# EAGLE design infant (EAGLE 6.4)
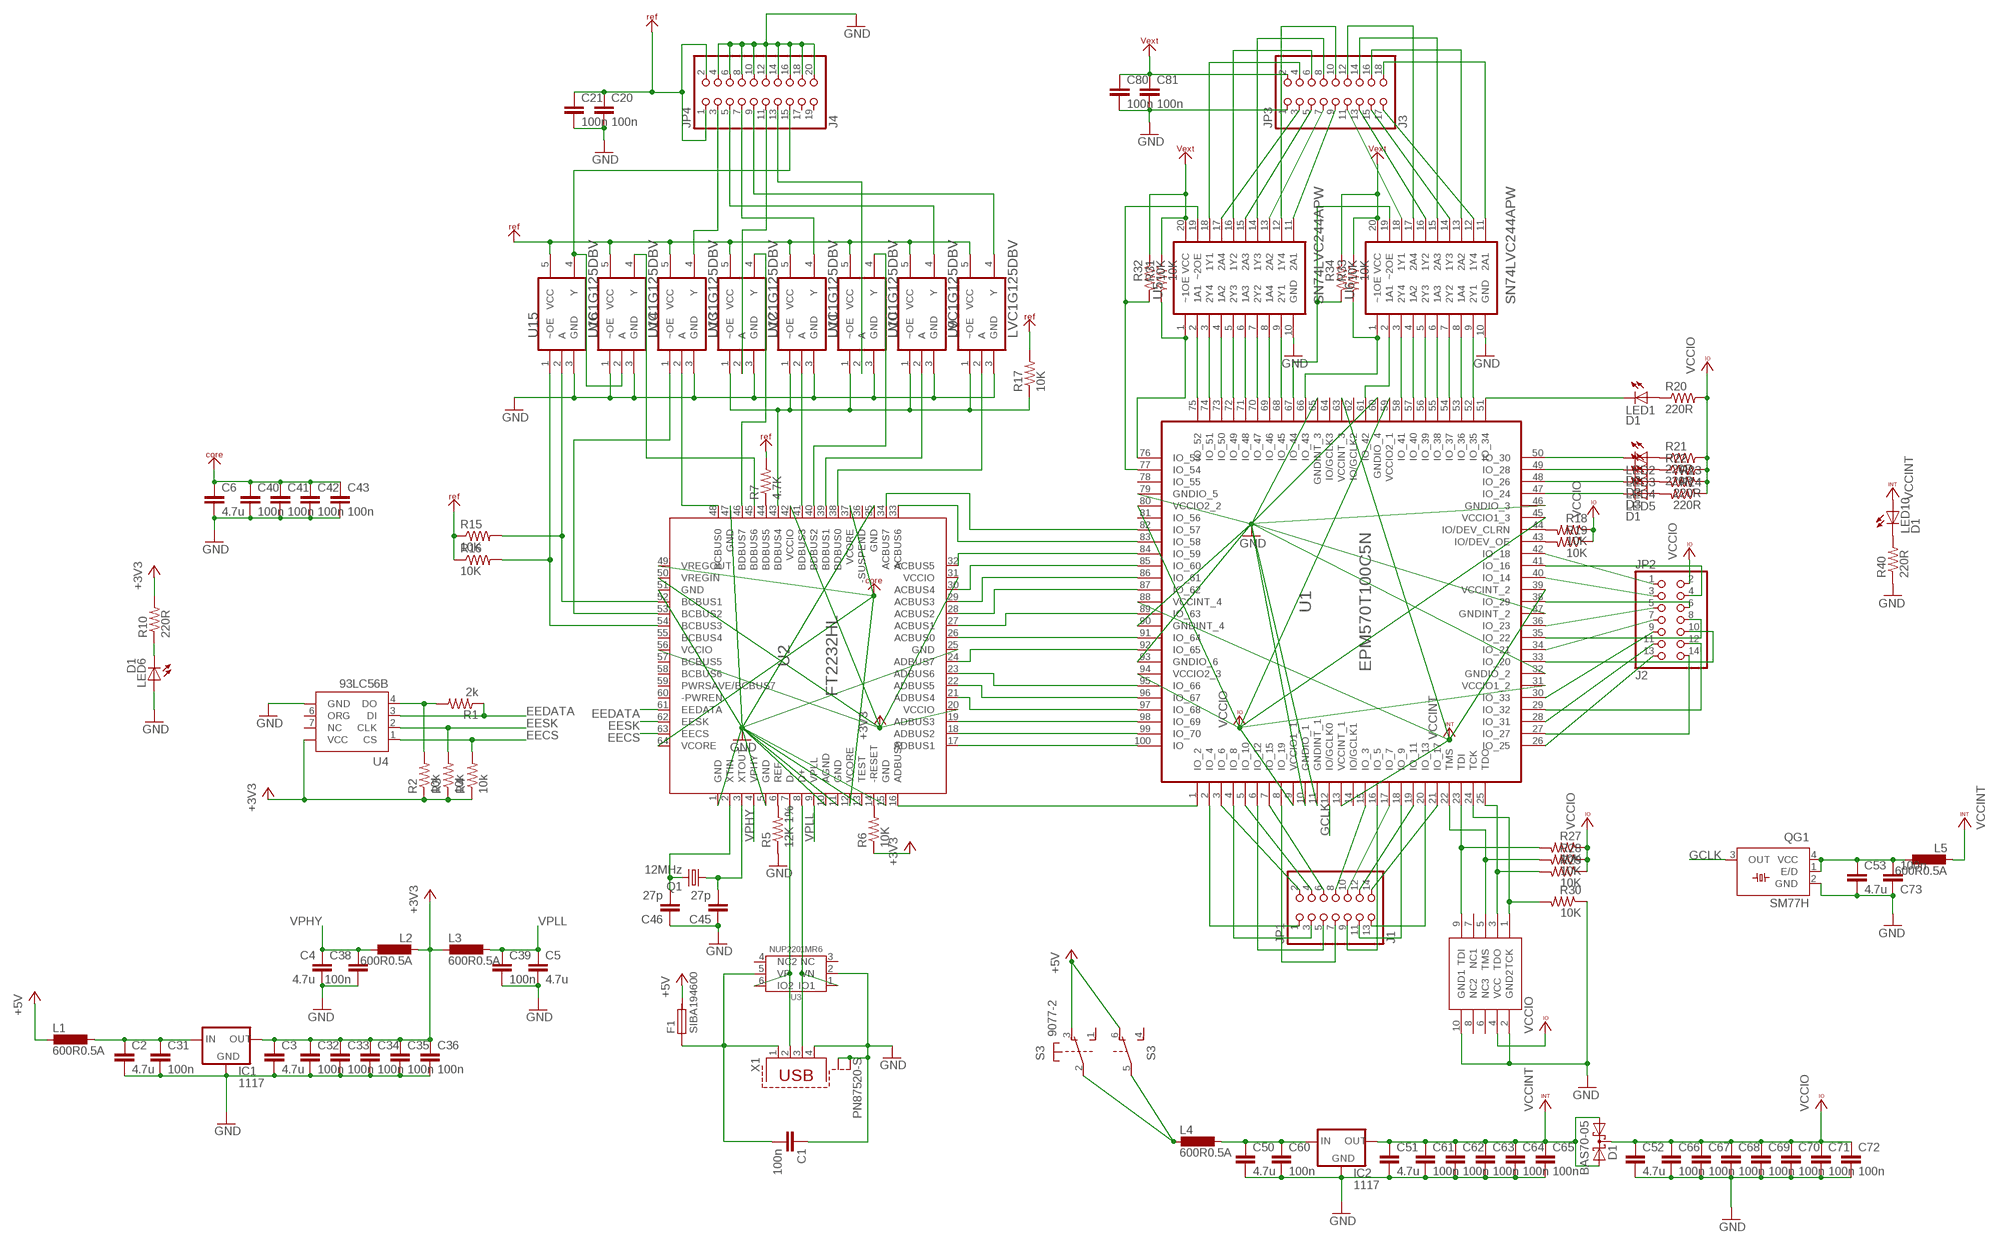
[diagram p0: schematic, sheet 1]

## Parts
C1  100n  C-EUC0805  [C0805]
C2  4.7u  C-EUC0805K  [C0805K]
C3  4.7u  C-EUC0805K  [C0805K]
C4  4.7u  C-EUC0805K  [C0805K]
C5  4.7u  C-EUC0805K  [C0805K]
C6  4.7u  C-EUC0805K  [C0805K]
C20  100n  C-EUC0805  [C0805]
C21  100n  C-EUC0805  [C0805]
C31  100n  C-EUC0805  [C0805]
C32  100n  C-EUC0805  [C0805]
C33  100n  C-EUC0805  [C0805]
C34  100n  C-EUC0805  [C0805]
C35  100n  C-EUC0805  [C0805]
C36  100n  C-EUC0805  [C0805]
C38  100n  C-EUC0805  [C0805]
C39  100n  C-EUC0805  [C0805]
C40  100n  C-EUC0805  [C0805]
C41  100n  C-EUC0805  [C0805]
C42  100n  C-EUC0805  [C0805]
C43  100n  C-EUC0805  [C0805]
C45  27p  C-EU025-025X050  [C025-025X050]
C46  27p  C-EU025-025X050  [C025-025X050]
C50  4.7u  C-EUC0805K  [C0805K]
C51  4.7u  C-EUC0805K  [C0805K]
C52  4.7u  C-EUC0805K  [C0805K]
C53  4.7u  C-EUC0805K  [C0805K]
C60  100n  C-EUC0805  [C0805]
C61  100n  C-EUC0805  [C0805]
C62  100n  C-EUC0805  [C0805]
C63  100n  C-EUC0805  [C0805]
C64  100n  C-EUC0805  [C0805]
C65  100n  C-EUC0805  [C0805]
C66  100n  C-EUC0805  [C0805]
C67  100n  C-EUC0805  [C0805]
C68  100n  C-EUC0805  [C0805]
C69  100n  C-EUC0805  [C0805]
C70  100n  C-EUC0805  [C0805]
C71  100n  C-EUC0805  [C0805]
C72  100n  C-EUC0805  [C0805]
C73  100n  C-EUC0805  [C0805]
C80  100n  C-EUC0805  [C0805]
C81  100n  C-EUC0805  [C0805]
D1  BAS70-05  [SOT23]
F1  SIBA194600  [C1812]
IC1  1117  LM1117  [SOT223]
IC2  1117  LM1117  [SOT223]
JP1  J1  PINHD-2X7  [2X07]
JP2  J2  PINHD-2X7  [2X07]
JP3  J3  PINHD-2X9  [2X09]
JP4  J4  PINHD-2X10  [2X10]
L1  600R0.5A  DO3316P  [R0805]
L2  600R0.5A  DO3316P  [R0805]
L3  600R0.5A  DO3316P  [R0805]
L4  600R0.5A  DO3316P  [R0805]
L5  600R0.5A  DO3316P  [R0805]
LED1  D1  LEDCHIPLED_0805  [CHIPLED_0805]
LED2  D2  LEDCHIPLED_0805  [CHIPLED_0805]
LED3  D3  LEDCHIPLED_0805  [CHIPLED_0805]
LED4  D3  LEDCHIPLED_0805  [CHIPLED_0805]
LED5  D1  LEDCHIPLED_0805  [CHIPLED_0805]
LED6  D1  LEDCHIPLED_0805  [CHIPLED_0805]
LED10  D1  LEDCHIPLED_0805  [CHIPLED_0805]
Q1  12MHz  CRYSTALHC49S  [HC49/S]
QG1  SM77H  [SM77H]
R1  2k  R-US_R0805  [R0805]
R2  10k  R-US_R0805  [R0805]
R3  10k  R-US_R0805  [R0805]
R4  10k  R-US_R0805  [R0805]
R5  12K 1%  R-US_R0805  [R0805]
R6  10K  R-US_R0805  [R0805]
R7  4.7K  R-US_R0805  [R0805]
R10  220R  R-US_R0805  [R0805]
R15  10K  R-US_R0805  [R0805]
R16  10K  R-US_R0805  [R0805]
R17  10K  R-US_R0805  [R0805]
R18  10K  R-US_R0805  [R0805]
R19  10K  R-US_R0805  [R0805]
R20  220R  R-US_R0805  [R0805]
R21  220R  R-US_R0805  [R0805]
R22  220R  R-US_R0805  [R0805]
R23  220R  R-US_R0805  [R0805]
R24  220R  R-US_R0805  [R0805]
R27  10K  R-US_R0805  [R0805]
R28  10K  R-US_R0805  [R0805]
R29  10K  R-US_R0805  [R0805]
R30  10K  R-US_R0805  [R0805]
R31  10K  R-US_R0805  [R0805]
R32  10K  R-US_R0805  [R0805]
R33  10K  R-US_R0805  [R0805]
R34  10K  R-US_R0805  [R0805]
R40  220R  R-US_R0805  [R0805]
S3  9077-2  [9077-2]
U1  EPM570T100C5N  SQUARE-QFP  [TQFP100]
U2  FT2232HL  [LQFP-64]
U3  NUP2201MR6  [TSOP6]
U4  93LC56B  PIN2PIN-SOIC8  [SOIC8]
U5  SN74LVC244APW  [TSSOP20]
U6  SN74LVC244APW  [TSSOP20]
U9  LVC1G125DBV  SN74LVC1G125DBVR  [SOT23-5]
U10  LVC1G125DBV  SN74LVC1G125DBVR  [SOT23-5]
U11  LVC1G125DBV  SN74LVC1G125DBVR  [SOT23-5]
U12  LVC1G125DBV  SN74LVC1G125DBVR  [SOT23-5]
U13  LVC1G125DBV  SN74LVC1G125DBVR  [SOT23-5]
U14  LVC1G125DBV  SN74LVC1G125DBVR  [SOT23-5]
U15  LVC1G125DBV  SN74LVC1G125DBVR  [SOT23-5]
U16  LVC1G125DBV  SN74LVC1G125DBVR  [SOT23-5]
U$2  BOXHEADER10JTAG  [ML10]
X1  PN87520-S  [USB]

## Nets
+3V3: C3.1 C32.1 C33.1 C34.1 C35.1 C36.1 IC1.2(OUT) L2.1 L3.1 R2.1 R3.1 R4.1 R6.1 R10.2 U2.20(VCCIO) U2.31(VCCIO) U2.42(VCCIO) U2.50(VREGIN) U2.56(VCCIO) U4.8(VCC)
+5V: F1.2 L1.1 S3.3(1:O) S3.6(2:O)
EECS: R4.2 U2.63(EECS) U4.1(CS)
EEDATA: R1.1 U2.61(EEDATA) U4.3(DI)
EESK: R3.2 U2.62(EESK) U4.2(CLK)
GCLK: QG1.3(OUT) U1.12(IO/GCLK0)
GND: C1.1 C2.2 C3.2 C4.2 C5.2 C6.2 C20.2 C21.2 C31.2 C32.2 C33.2 C34.2 C35.2 C36.2 C38.2 C39.2 C40.2 C41.2 C42.2 C43.2 C45.1 C46.1 C50.2 C51.2 C52.2 C53.2 C60.2 C61.2 C62.2 C63.2 C64.2 C65.2 C66.2 C67.2 C68.2 C69.2 C70.2 C71.2 C72.2 C73.1 C80.2 C81.2 IC1.1(GND) IC2.1(GND) JP3.1 JP4.4 JP4.6 JP4.8 JP4.10 JP4.12 JP4.14 JP4.16 JP4.18 JP4.20 LED6.A QG1.2(GND) R5.1 R30.1 R40.1 U1.10(GNDIO_1) U1.11(GNDINT_1) U1.32(GNDIO_2) U1.37(GNDINT_2) U1.46(GNDIO_3) U1.60(GNDIO_4) U1.65(GNDINT_3) U1.79(GNDIO_5) U1.90(GNDINT_4) U1.93(GNDIO_6) U2.1(GND) U2.5(GND) U2.10(AGND) U2.11(GND) U2.13(TEST) U2.15(GND) U2.25(GND) U2.35(GND) U2.47(GND) U2.51(GND) U3.2(VN) U4.5(GND) U5.10(GND) U6.10(GND) U9.3(GND) U10.3(GND) U11.3(GND) U12.3(GND) U13.3(GND) U14.3(GND) U15.3(GND) U16.1(~OE) U16.3(GND) U$2.2(GND2) U$2.10(GND1) X1.4 X1.S1 X1.S2
N$1: U2.7(D-) U3.6(IO2) X1.2
N$2: U2.8(D+) U3.1(IO1) X1.3
N$3: C2.1 C31.1 IC1.3(IN) L1.2
N$4: C46.2 Q1.2 U2.2(XTIN)
N$5: C45.2 Q1.1 U2.3(XTOUT)
N$6: U1.1(IO_2) U2.16(ADBUS0)
N$7: U1.100(IO) U2.17(ADBUS1)
N$8: U1.99(IO_70) U2.18(ADBUS2)
N$9: U1.98(IO_69) U2.19(ADBUS3)
N$10: U1.97(IO_68) U2.21(ADBUS4)
N$11: U1.96(IO_67) U2.22(ADBUS5)
N$12: U1.95(IO_66) U2.23(ADBUS6)
N$13: R1.2 R2.2 U4.4(DO)
N$14: U1.92(IO_65) U2.24(ADBUS7)
N$15: R5.2 U2.6(REF)
N$16: U1.91(IO_64) U2.26(ACBUS0)
N$17: C50.1 C60.1 IC2.3(IN) L4.2
N$18: LED3.A R22.1
N$19: LED2.A R21.1
N$20: C53.1 C73.2 L5.2 QG1.1(E/D) QG1.4(VCC)
N$21: LED1.A R20.1
N$22: U1.89(IO_63) U2.27(ACBUS1)
N$24: U1.87(IO_62) U2.28(ACBUS2)
N$25: U1.86(IO_61) U2.29(ACBUS3)
N$27: R6.2 U2.14(-RESET)
N$28: U2.38(BDBUS0) U9.2(A)
N$29: U1.85(IO_60) U2.30(ACBUS4)
N$30: U1.84(IO_59) U2.32(ACBUS5)
N$31: U2.39(BDBUS1) U10.2(A)
N$32: U1.83(IO_58) U2.33(ACBUS6)
N$33: U2.41(BDBUS3) U12.2(A)
N$34: U1.82(IO_57) U2.34(ACBUS7)
N$35: U1.52(IO_35) U6.9(2Y1)
N$36: U1.53(IO_36) U6.8(1A4)
N$37: U1.54(IO_37) U6.7(2Y2)
N$38: U1.55(IO_38) U6.6(1A3)
N$39: U1.56(IO_39) U6.5(2Y3)
N$40: U1.57(IO_40) U6.4(1A2)
N$41: U1.58(IO_41) U6.3(2Y4)
N$42: U1.61(IO_42) U6.2(1A1)
N$43: R33.2 U1.66(IO_43) U6.1(~1OE)
N$44: R34.2 U1.67(IO_44) U6.19(~2OE)
N$45: U1.68(IO_45) U5.9(2Y1)
N$46: U1.69(IO_46) U5.8(1A4)
N$47: U1.70(IO_47) U5.7(2Y2)
N$48: U1.71(IO_48) U5.6(1A3)
N$49: U1.72(IO_49) U5.5(2Y3)
N$50: U1.73(IO_50) U5.4(1A2)
N$51: U1.74(IO_51) U5.3(2Y4)
N$52: U1.75(IO_52) U5.2(1A1)
N$54: R31.2 U1.76(IO_53) U5.1(~1OE)
N$55: R32.2 U1.77(IO_54) U5.19(~2OE)
N$56: U2.40(BDBUS2) U11.4(Y)
N$57: R15.2 U2.52(BCBUS1) U15.2(A)
N$58: U2.48(BCBUS0) U14.2(A)
N$59: U2.53(BCBUS2) U14.1(~OE)
N$60: R16.2 U2.54(BCBUS3) U15.1(~OE)
N$61: U2.46(BDBUS7) U13.4(Y)
N$62: U2.45(BDBUS6) U16.4(Y)
N$63: LED4.A R23.2
N$64: LED2.C U1.50(IO_30)
N$65: LED3.C U1.49(IO_28)
N$66: L4.1 S3.2(1:P) S3.5(2:P)
N$67: LED4.C U1.48(IO_26)
N$68: JP2.14 U1.27(IO_27)
N$69: R27.2 U1.23(TDI) U$2.9(TDI)
N$70: R28.2 U1.22(TMS) U$2.5(TMS)
N$71: R30.2 U1.24(TCK) U$2.1(TCK)
N$72: R29.2 U1.25(TDO) U$2.3(TDO)
N$73: JP2.1 U1.42(IO_18)
N$74: JP2.3 U1.40(IO_14)
N$75: JP3.9 U5.11(2A1)
N$76: JP3.7 U5.13(2A2)
N$77: JP3.5 U5.15(2A3)
N$78: JP3.3 U5.17(2A4)
N$79: JP3.11 U6.18(1Y1)
N$80: JP3.13 U6.16(1Y2)
N$81: JP3.15 U6.14(1Y3)
N$82: JP3.17 U6.12(1Y4)
N$83: JP3.4 U5.18(1Y1)
N$84: JP3.6 U5.16(1Y2)
N$85: JP3.8 U5.14(1Y3)
N$86: JP3.10 U5.12(1Y4)
N$87: JP3.12 U6.17(2A4)
N$88: JP3.14 U6.15(2A3)
N$89: JP3.16 U6.13(2A2)
N$90: JP3.18 U6.11(2A1)
N$91: JP2.12 U1.29(IO_32)
N$92: JP2.13 U1.26(IO_25)
N$93: JP2.11 U1.28(IO_31)
N$94: JP2.10 U1.33(IO_20)
N$95: R18.2 U1.44(IO/DEV_CLRN)
N$96: R19.2 U1.43(IO/DEV_OE)
N$97: JP2.5 U1.36(IO_23)
N$98: JP2.9 U1.30(IO_33)
N$99: JP2.8 U1.35(IO_22)
N$100: JP2.7 U1.34(IO_21)
N$101: JP2.4 U1.41(IO_16)
N$102: JP2.6 U1.38(IO_29)
N$103: LED5.A R24.2
N$104: JP1.1 U1.2(IO_4)
N$105: JP1.2 U1.3(IO_6)
N$106: JP1.3 U1.4(IO_8)
N$107: JP1.8 U1.15(IO_3)
N$108: JP1.6 U1.7(IO_15)
N$109: JP1.10 U1.17(IO_7)
N$110: JP1.12 U1.19(IO_11)
N$111: JP1.7 U1.8(IO_19)
N$112: JP1.14 U1.21(IO_17)
N$113: JP1.13 U1.20(IO_13)
N$114: JP1.5 U1.6(IO_12)
N$115: JP1.11 U1.18(IO_9)
N$116: JP1.9 U1.16(IO_5)
N$117: JP1.4 U1.5(IO_10)
N$118: R7.1 U2.44(BDBUS5)
N$119: JP4.11 U13.2(A)
N$120: JP4.5 U10.4(Y)
N$121: JP4.3 U14.4(Y)
N$122: LED5.C U1.47(IO_24)
N$123: JP4.9 U9.4(Y)
N$124: JP4.7 U12.4(Y)
N$125: JP4.13 U11.2(A)
N$126: JP4.15 U15.4(Y) U16.2(A)
N$127: R17.1 U2.43(BDBUS4) U9.1(~OE) U10.1(~OE) U11.1(~OE) U12.1(~OE) U13.1(~OE)
N$128: C1.2 F1.1 U3.5(VP) X1.1
N$129: LED10.C R40.2
N$130: LED1.C U1.51(IO_34)
N$131: LED6.C R10.1
VCC: C20.1 C21.1 JP4.1 JP4.2 R7.2 R15.1 R16.1 R17.2 U9.5(VCC) U10.5(VCC) U11.5(VCC) U12.5(VCC) U13.5(VCC) U14.5(VCC) U15.5(VCC) U16.5(VCC) ; supply symbol labelled VREF
VCCINT: C51.1 C61.1 C62.1 C63.1 C64.1 C65.1 D1.1(A1) D1.2(A2) IC2.2(OUT) L5.1 LED10.A U1.13(VCCINT_1) U1.39(VCCINT_2) U1.63(VCCINT_3) U1.88(VCCINT_4)
VCCIO: C52.1 C66.1 C67.1 C68.1 C69.1 C70.1 C71.1 C72.1 D1.3(C) JP2.2 R18.1 R19.1 R20.2 R21.2 R22.2 R23.1 R24.1 R27.1 R28.1 R29.1 U1.9(VCCIO1_1) U1.31(VCCIO1_2) U1.45(VCCIO1_3) U1.59(VCCIO2_1) U1.80(VCCIO2_2) U1.94(VCCIO2_3) U$2.4(VCC)
VCORE: C6.1 C40.1 C41.1 C42.1 C43.1 U2.12(VCORE) U2.37(VCORE) U2.49(VREGOUT) U2.64(VCORE)
VEXT: C80.1 C81.1 JP3.2 R31.1 R32.1 R33.1 R34.1 U5.20(VCC) U6.20(VCC)
VPHY: C4.1 C38.1 L2.2 U2.4(VPHY)
VPLL: C5.1 C39.1 L3.2 U2.9(VPLL)
Unconnected: JP4.17 JP4.19 S3.1(1:S) S3.4(2:S) U1.14(IO/GCLK1) U1.62(IO/GCLK2) U1.64(IO/GCLK3) U1.78(IO_55) U1.81(IO_56) U2.36(-SUSPEND) U2.55(BCBUS4) U2.57(BCBUS5) U2.58(BCBUS6) U2.59(PWRSAVE/BCBUS7) U2.60(-PWREN) U3.3(NC) U3.4(NC2) U4.6(ORG) U4.7(NC) U$2.6(NC3) U$2.7(NC1) U$2.8(NC2)

## Library data of the parts
C1-C6 C20 C21 C31-C36 C38-C43 C45 C46 C50-C53 C60-C73 C80 C81 = rcl:C-EU: CAPACITOR, European symbol
D1 = diode:BAS70-05: Silicon Schottky Diodes General-purpose diode for high-speed switching
F1 = others:SIBA194600
IC1 IC2 = v-reg-2:LM1117
JP1 JP2 = pinhead:PINHD-2X7: PIN HEADER
JP3 = pinhead:PINHD-2X9: PIN HEADER
JP4 = pinhead:PINHD-2X10: PIN HEADER
L1-L5 = others:DO3316P: COILCRAFT
LED1-LED6 LED10 = led:LED: LED OSRAM: - CHIPLED LG R971, LG N971, LY N971, LG Q971, LY Q971, LO R971, LY R971 LH N974, LH R974 LS Q976, LO Q976, LY Q976 LO Q996 - Hyper CHIPLED LW Q18S LB Q993, LB Q99A, LB R99A - SideLED LS A670, LO A670, LY A670, LG A670, LP A670 LB A673, LV A673, LT A673, LW A673 LH A674 LY A675 LS A676, LA A676, LO A676, LY A676, LW A676 LS A679, LY A679, LG A679 - Hyper Micro SIDELED® LS Y876, LA Y876, LO Y876, LY Y876 LT Y87S - SmartLED LW L88C, LW L88S LB L89C, LB L89S, LG L890 LS L89K, LO L89K, LY L89K LS L896, LA L896, LO L896, LY L896 - TOPLED LS T670, LO T670, LY T670, LG T670, LP T670 LSG T670, LSP T670, LSY T670, LOP T670, LYG T670 LG T671, LOG T671, LSG T671 LB T673, LV T673, LT T673, LW T673 LH T674 LS T676, LA T676, LO T676, LY T676, LB T676, LH T676, LSB T676, LW T676 LB T67C, LV T67C, LT T67C, LS T67K, LO T67K, LY T67K, LW E67C LS E67B, LA E67B, LO E67B, LY E67B, LB E67C, LV E67C, LT E67C LW T67C LS T679, LY T679, LG T679 LS T770, LO T770, LY T770, LG T770, LP T770 LB T773, LV T773, LT T773, LW T773 LH T774 LS E675, LA E675, LY E675, LS T675 LS T776, LA T776, LO T776, LY T776, LB T776 LHGB T686 LT T68C, LB T68C - Hyper Mini TOPLED® LB M676 - Mini TOPLED Santana® LG M470 LS M47K, LO M47K, LY M47K Source: http://www.osram.convergy.de LUXEON: - LUMILED® LXK2-PW12-R00, LXK2-PW12-S00, LXK2-PW14-U00, LXK2-PW14-V00 LXK2-PM12-R00, LXK2-PM12-S00, LXK2-PM14-U00 LXK2-PE12-Q00, LXK2-PE12-R00, LXK2-PE12-S00, LXK2-PE14-T00, LXK2-PE14-U00 LXK2-PB12-K00, LXK2-PB12-L00, LXK2-PB12-M00, LXK2-PB14-N00, LXK2-PB14-P00, LXK2-PB14-Q00 LXK2-PR12-L00, LXK2-PR12-M00, LXK2-PR14-Q00, LXK2-PR14-R00 LXK2-PD12-Q00, LXK2-PD12-R00, LXK2-PD12-S00 LXK2-PH12-R00, LXK2-PH12-S00 LXK2-PL12-P00, LXK2-PL12-Q00, LXK2-PL12-R00 Source: www.luxeon.com KINGBRIGHT: KA-3528ASYC Source: www.kingbright.com
Q1 = crystal:CRYSTAL: CRYSTAL; OC_FARNELL: 1667008; OC_NEWARK: unknown
QG1 = crystal:SM77H: 3.3V CMOS Clock Oscillator Source: www.pletronics.com .. sm77h%203.3v.pdf; OC_FARNELL: unknown; OC_NEWARK: unknown
R1-R7 R10 R15-R24 R27-R34 R40 = rcl:R-US_: RESISTOR, American symbol
S3 = switch-misc:9077-2: MARQUARDT SWITCH 9077.0200 Distributor: Buerklin <https://www.buerklin.com/default.asp?event=ShowArtikel%2812G2822%29&l=d&jump=ArtNr_12G2822>
U1 = epm570t100:SQUARE-QFP
U2 = ft2232hl:FT2232HL
U3 = NUP2201MR6:NUP2201MR6
U4 = 93LC56B:PIN2PIN-SOIC8
U5 U6 = sn74lvc244:SN74LVC244APW: OCTAL BUFFER/DRIVER; MPN: SN74LVC244APW; OC_FARNELL: 1470725; OC_NEWARK: 02H5433; PACKAGE: TSSOP-20; SUPPLIER: Texas Instruments
U9-U16 = sn74lvc125:SN74LVC1G125DBVR: SINGLE BUS BUFFER GATE WITH 3-STATE OUTPUT; MPN: SN74LVC1G125DBVR; OC_FARNELL: 1470768; OC_NEWARK: 74C1414; PACKAGE: SOT-23-5; SUPPLIER: Texas Instruments
U$2 = dc3_boxheader:BOXHEADER10JTAG
X1 = con-usb:PN87520-S; OC_FARNELL: unknown; OC_NEWARK: unknown

## Board
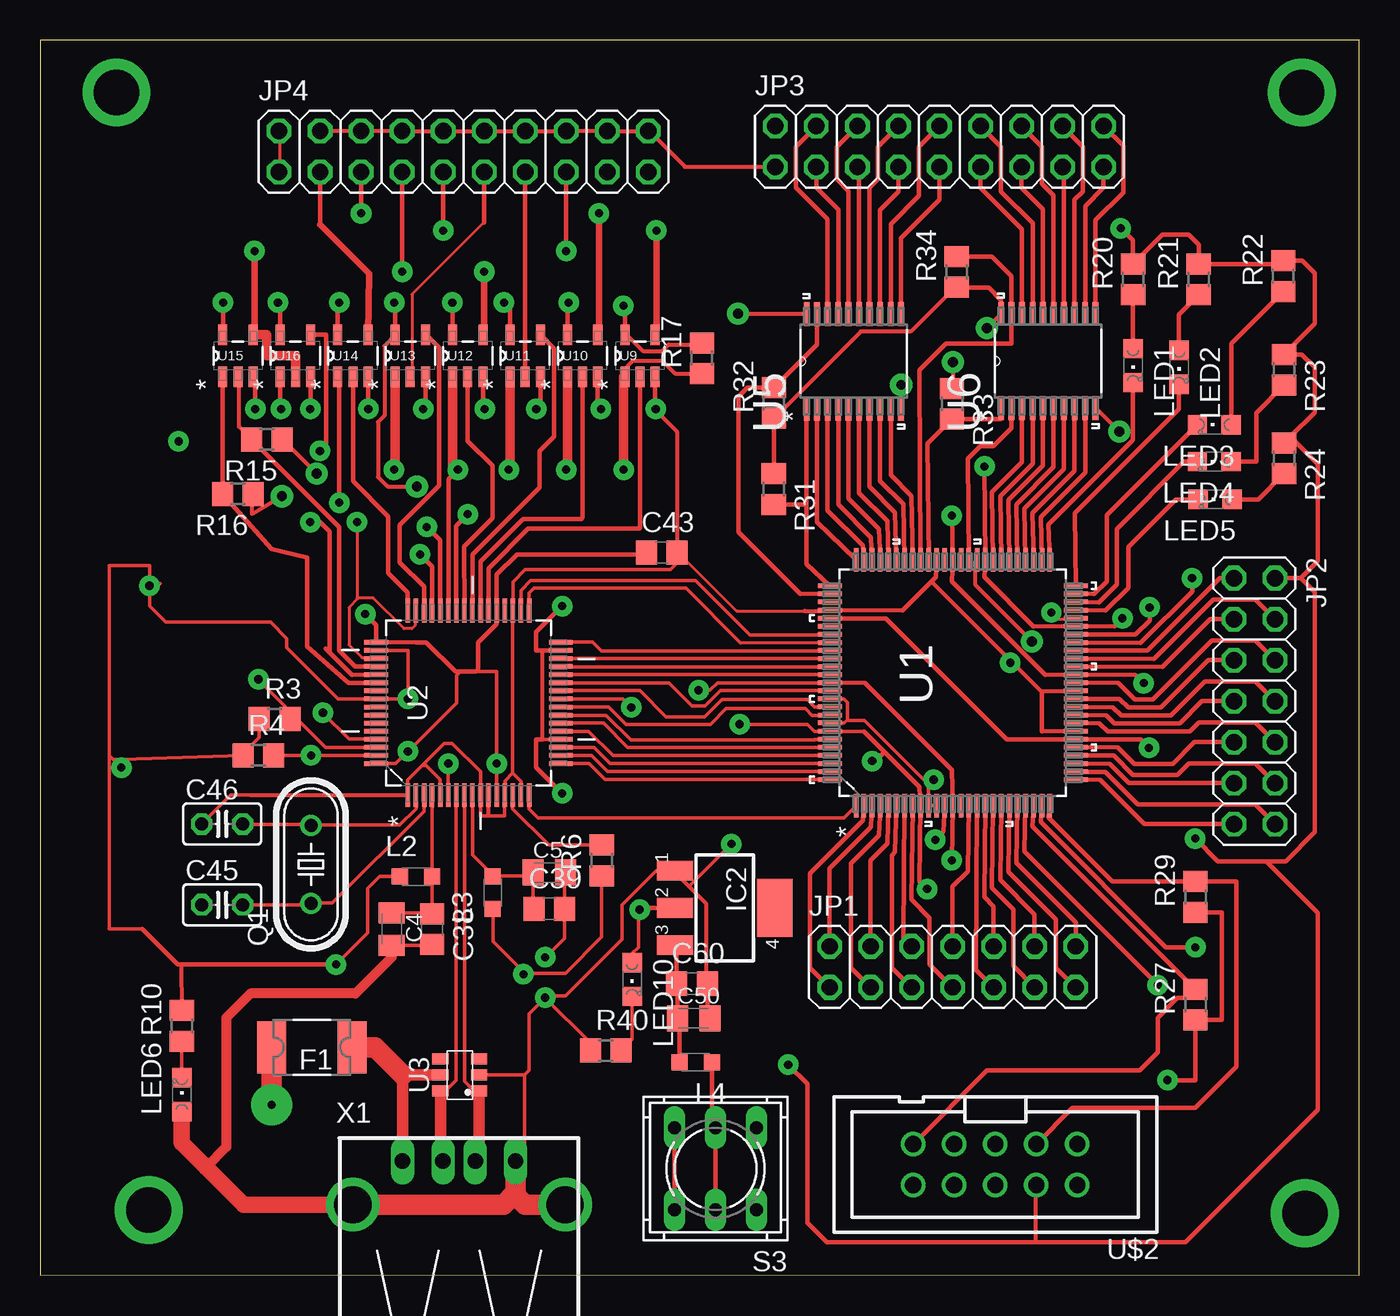
[diagram p1: board, top side]
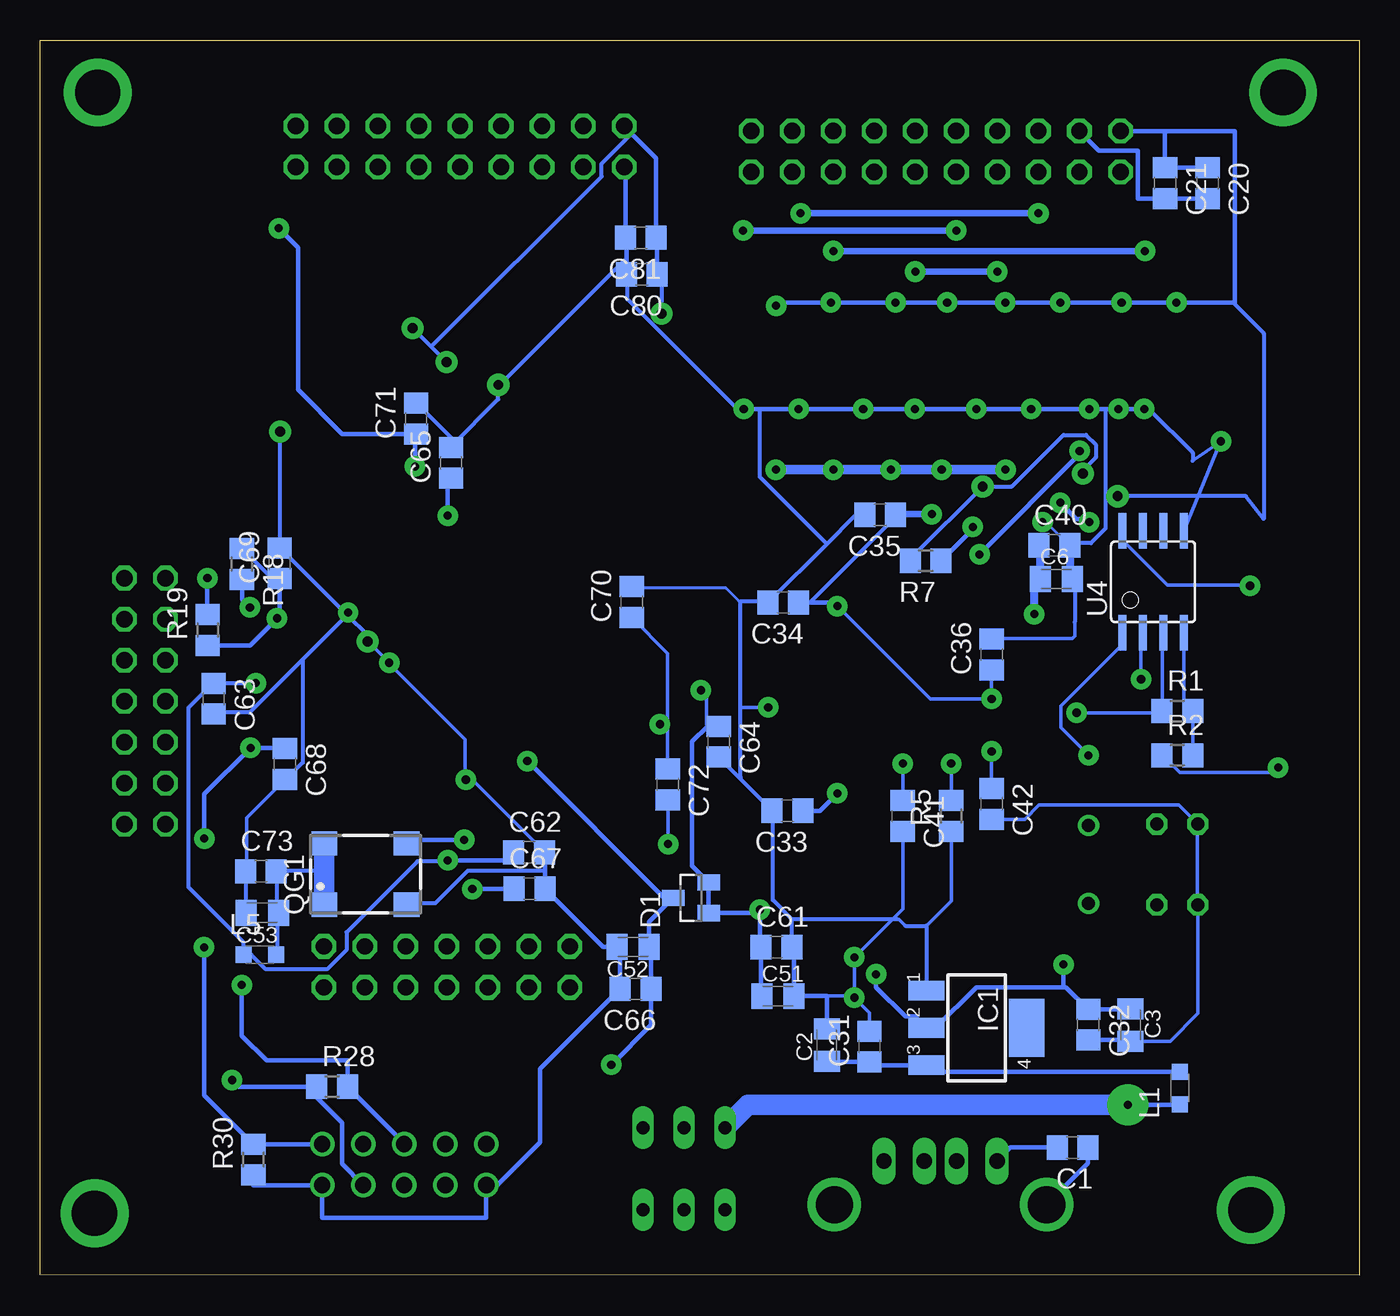
[diagram p2: board, bottom side, seen from below]

Size 81.67 x 76.48 mm. Coordinates in mm from the lower left corner, seen from the top.
Outline: 0,0 81.67,0.05 81.67,76.48 0,76.48 0,0
Copper layers (1*16): Top 0.035mm / dielectric 1.5mm / Bottom 0.035mm
Design rules "openjtag": minimum track width 9mil, minimum drill 20mil, track to track 9mil, track to pad 8mil, pad to pad 8mil, via to via 9mil, smd to smd 8mil, copper to edge 40mil, drill to drill 9mil, minimum pad ring 10mil, minimum via ring 15mil, stop-mask expansion 4mil, vias tented up to drill 1mil, thermal gap 10mil

### Footprints (pad centres in the part's own frame; a part is rotated, then mirrored left to right if it is on the bottom)
C0805 = smd 1.3 x 1.5: 1 -0.95,0; 2 0.95,0
C0805K = smd 1.3 x 1.6: 1 -1,0; 2 1,0
C025-025X050 = drill 0.813 octagon: 1 -1.27,0; 2 1.27,0
SOT23 = smd 1 x 1.4: 1 -0.95,-1.1; 2 0.95,-1.1; 3 0,1.1
C1812 = smd 1.78 x 3.2: 1 -2.49,0; 2 2.49,0
SOT223 = smd 1.219 x 2.235: 1 -2.311,-3.099; 2 0,-3.099; 3 2.311,-3.099 | smd 3.6 x 2.2: 4 0,3.099
2X07 = drill 1.016 octagon: 1 -7.62,-1.27; 2 -7.62,1.27; 3 -5.08,-1.27; 4 -5.08,1.27; 5 -2.54,-1.27; 6 -2.54,1.27; 7 0,-1.27; 8 0,1.27; 9 2.54,-1.27; 10 2.54,1.27; 11 5.08,-1.27; 12 5.08,1.27; 13 7.62,-1.27; 14 7.62,1.27
2X09 = drill 1.016 octagon: 1 -10.16,-1.27; 2 -10.16,1.27; 3 -7.62,-1.27; 4 -7.62,1.27; 5 -5.08,-1.27; 6 -5.08,1.27; 7 -2.54,-1.27; 8 -2.54,1.27; 9 0,-1.27; 10 0,1.27; 11 2.54,-1.27; 12 2.54,1.27; 13 5.08,-1.27; 14 5.08,1.27; 15 7.62,-1.27; 16 7.62,1.27; 17 10.16,-1.27; 18 10.16,1.27
2X10 = drill 1.016 octagon: 1 -11.43,-1.27; 2 -11.43,1.27; 3 -8.89,-1.27; 4 -8.89,1.27; 5 -6.35,-1.27; 6 -6.35,1.27; 7 -3.81,-1.27; 8 -3.81,1.27; 9 -1.27,-1.27; 10 -1.27,1.27; 11 1.27,-1.27; 12 1.27,1.27; 13 3.81,-1.27; 14 3.81,1.27; 15 6.35,-1.27; 16 6.35,1.27; 17 8.89,-1.27; 18 8.89,1.27; 19 11.43,-1.27; 20 11.43,1.27
R0805 = smd 1 x 1: 1 -1,0; 2 1,0
CHIPLED_0805 = smd 1.2 x 1.2: A 0,-1.05; C 0,1.05
HC49/S = drill 0.813: 1 -2.413,0; 2 2.413,0
SM77H = smd 1.6 x 1.5: 1 -2.55,-1.9; 2 2.55,-1.9; 3 2.55,1.9; 4 -2.55,1.9
R0805' = smd 1.3 x 1.5: 1 -0.95,0; 2 0.95,0
9077-2 = drill 0.813 long: 1 -2.54,2.54; 2 0,2.54; 3 2.54,2.54; 4 -2.54,-2.54; 5 0,-2.54; 6 2.54,-2.54
TQFP100 = smd 1.473 x 0.279: 1 -7.62,5.994; 2 -7.62,5.512; 3 -7.62,5.004; 4 -7.62,4.496; 5 -7.62,3.988; 6 -7.62,3.505; 7 -7.62,2.997; 8 -7.62,2.489; 9 -7.62,2.007; 10 -7.62,1.499; 11 -7.62,0.991; 12 -7.62,0.508; 13 -7.62,0; 14 -7.62,-0.508; 15 -7.62,-0.991; 16 -7.62,-1.499; 17 -7.62,-2.007; 18 -7.62,-2.489; 19 -7.62,-2.997; 20 -7.62,-3.505; 21 -7.62,-3.988; 22 -7.62,-4.496; 23 -7.62,-5.004; 24 -7.62,-5.512; 25 -7.62,-5.994; 51 7.62,-5.994; 52 7.62,-5.512; 53 7.62,-5.004; 54 7.62,-4.496; 55 7.62,-3.988; 56 7.62,-3.505; 57 7.62,-2.997; 58 7.62,-2.489; 59 7.62,-2.007; 60 7.62,-1.499; 61 7.62,-0.991; 62 7.62,-0.508; 63 7.62,0; 64 7.62,0.508; 65 7.62,0.991; 66 7.62,1.499; 67 7.62,2.007; 68 7.62,2.489; 69 7.62,2.997; 70 7.62,3.505; 71 7.62,3.988; 72 7.62,4.496; 73 7.62,5.004; 74 7.62,5.512; 75 7.62,5.994 | smd 0.279 x 1.473: 26 -5.994,-7.62; 27 -5.512,-7.62; 28 -5.004,-7.62; 29 -4.496,-7.62; 30 -3.988,-7.62; 31 -3.505,-7.62; 32 -2.997,-7.62; 33 -2.489,-7.62; 34 -2.007,-7.62; 35 -1.499,-7.62; 36 -0.991,-7.62; 37 -0.508,-7.62; 38 0,-7.62; 39 0.508,-7.62; 40 0.991,-7.62; 41 1.499,-7.62; 42 2.007,-7.62; 43 2.489,-7.62; 44 2.997,-7.62; 45 3.505,-7.62; 46 3.988,-7.62; 47 4.496,-7.62; 48 5.004,-7.62; 49 5.512,-7.62; 50 5.994,-7.62; 76 5.994,7.62; 77 5.512,7.62; 78 5.004,7.62; 79 4.496,7.62; 80 3.988,7.62; 81 3.505,7.62; 82 2.997,7.62; 83 2.489,7.62; 84 2.007,7.62; 85 1.499,7.62; 86 0.991,7.62; 87 0.508,7.62; 88 0,7.62; 89 -0.508,7.62; 90 -0.991,7.62; 91 -1.499,7.62; 92 -2.007,7.62; 93 -2.489,7.62; 94 -2.997,7.62; 95 -3.505,7.62; 96 -3.988,7.62; 97 -4.496,7.62; 98 -5.004,7.62; 99 -5.512,7.62; 100 -5.994,7.62
LQFP-64 = smd 1.473 x 0.279: 1 -5.715,3.759; 2 -5.715,3.251; 3 -5.715,2.743; 4 -5.715,2.261; 5 -5.715,1.753; 6 -5.715,1.245; 7 -5.715,0.762; 8 -5.715,0.254; 9 -5.715,-0.254; 10 -5.715,-0.762; 11 -5.715,-1.245; 12 -5.715,-1.753; 13 -5.715,-2.261; 14 -5.715,-2.743; 15 -5.715,-3.251; 16 -5.715,-3.759; 33 5.715,-3.759; 34 5.715,-3.251; 35 5.715,-2.743; 36 5.715,-2.261; 37 5.715,-1.753; 38 5.715,-1.245; 39 5.715,-0.762; 40 5.715,-0.254; 41 5.715,0.254; 42 5.715,0.762; 43 5.715,1.245; 44 5.715,1.753; 45 5.715,2.261; 46 5.715,2.743; 47 5.715,3.251; 48 5.715,3.759 | smd 0.279 x 1.473: 17 -3.759,-5.715; 18 -3.251,-5.715; 19 -2.743,-5.715; 20 -2.261,-5.715; 21 -1.753,-5.715; 22 -1.245,-5.715; 23 -0.762,-5.715; 24 -0.254,-5.715; 25 0.254,-5.715; 26 0.762,-5.715; 27 1.245,-5.715; 28 1.753,-5.715; 29 2.261,-5.715; 30 2.743,-5.715; 31 3.251,-5.715; 32 3.759,-5.715; 49 3.759,5.715; 50 3.251,5.715; 51 2.743,5.715; 52 2.261,5.715; 53 1.753,5.715; 54 1.245,5.715; 55 0.762,5.715; 56 0.254,5.715; 57 -0.254,5.715; 58 -0.762,5.715; 59 -1.245,5.715; 60 -1.753,5.715; 61 -2.261,5.715; 62 -2.743,5.715; 63 -3.251,5.715; 64 -3.759,5.715
TSOP6 = smd 0.7 x 1: 1 -0.99,-1.2; 2 0,-1.2; 3 0.99,-1.2; 4 0.99,1.2; 5 0,1.2; 6 -0.99,1.2
SOIC8 = smd 0.5 x 2.2: 1 -1.905,-3.154; 2 -0.645,-3.154; 3 0.625,-3.154; 4 1.895,-3.154; 5 1.905,3.154; 6 0.635,3.154; 7 -0.635,3.154; 8 -1.905,3.154
TSSOP20 = smd 1.473 x 0.356: 1 -2.921,2.921; 2 -2.921,2.286; 3 -2.921,1.626; 4 -2.921,0.965; 5 -2.921,0.33; 6 -2.921,-0.33; 7 -2.921,-0.965; 8 -2.921,-1.626; 9 -2.921,-2.286; 10 -2.921,-2.921; 11 2.921,-2.921; 12 2.921,-2.286; 13 2.921,-1.626; 14 2.921,-0.965; 15 2.921,-0.33; 16 2.921,0.33; 17 2.921,0.965; 18 2.921,1.626; 19 2.921,2.286; 20 2.921,2.921
SOT23-5 = smd 1.27 x 0.559: 1 -1.295,0.94; 2 -1.295,0; 3 -1.295,-0.94; 4 1.295,-0.94; 5 1.295,0.94
ML10 = drill 1 pad 1.422: 1 -5.08,-1.27; 2 -5.08,1.27; 3 -2.54,-1.27; 4 -2.54,1.27; 5 0,-1.27; 6 0,1.27; 7 2.54,-1.27; 8 2.54,1.27; 9 5.08,-1.27; 10 5.08,1.27
USB = drill 0.95 long: 1 -3.5,2.71; 2 -1,2.71; 3 1,2.71; 4 3.5,2.71 | drill 2.3 pad 2.9: S1 -6.57,0; S2 6.57,0

### Placement (x,y rotation side)
C1  17.75,7.92 180 bottom
C2  32.97,14.26 90 bottom
C3  14.16,15.5 270 bottom
C4  21.76,21.45 270 top
C5  31.51,24.95 0 top
C6  18.75,43.12 0 bottom
C20  9.38,67.64 270 bottom
C21  12.02,67.64 270 bottom
C31  30.32,14.16 90 bottom
C32  16.77,15.52 270 bottom
C33  35.41,28.77 180 bottom
C34  35.66,41.67 180 bottom
C35  29.66,47.09 180 bottom
C36  22.76,38.45 90 bottom
C38  24.26,21.45 270 top
C39  31.51,22.7 0 top
C40  18.87,45.21 0 bottom
C41  28.26,28.45 270 bottom
C42  22.76,29.2 270 bottom
C43  38.49,44.76 0 top
C45  11.26,22.95 0 top
C46  11.26,27.95 0 top
C50  40.45,15.92 0 top
C51  35.99,17.29 0 bottom
C52  44.97,20.34 180 bottom
C53  67.92,22.45 180 bottom
C60  40.36,18.07 0 top
C61  36.08,20.32 0 bottom
C62  51.4,26.2 0 bottom
C63  70.93,35.71 270 bottom
C64  39.66,33.05 270 bottom
C65  56.23,50.31 90 bottom
C66  44.81,17.74 180 bottom
C67  51.37,23.94 0 bottom
C68  66.52,31.66 270 bottom
C69  66.85,44.09 90 bottom
C70  45.05,41.7 90 bottom
C71  58.4,53.06 90 bottom
C72  42.82,30.4 270 bottom
C73  68,25.02 0 bottom
C80  44.42,61.98 180 bottom
C81  44.48,64.25 180 bottom
D1  41.38,23.38 90 bottom
F1  16.81,14.12 180 top
IC1  23.69,15.33 270 bottom
IC2  42.39,22.75 270 top
JP1  56.49,19.1 0 top
JP2  75.18,35.56 270 top
JP3  55.68,69.9 0 top
JP4  26.21,69.6 0 top
L1  11.11,11.6 90 bottom
L2  23.26,24.7 0 top
L3  28.01,23.7 90 top
L4  40.58,13.2 180 top
L5  68.07,19.86 0 bottom
LED1  67.67,56.34 180 top
LED2  70.51,56.24 180 top
LED3  72.69,52.68 90 top
LED4  72.69,50.39 90 top
LED5  72.75,48.06 90 top
LED6  8.76,11.2 0 top
LED10  36.64,18.32 180 top
Q1  16.76,25.45 90 top
QG1  61.53,24.85 0 bottom
R1  2k  [R0805']  11.26,34.95 0 bottom
R2  10k  [R0805']  11.26,32.2 0 bottom
R3  10k  [R0805']  14.51,34.45 0 top
R4  10k  [R0805']  13.51,32.2 0 top
R5  12K 1%  [R0805']  25.26,28.45 90 bottom
R6  10K  [R0805']  34.76,25.7 90 top
R7  4.7K  [R0805']  26.85,44.25 180 bottom
R10  220R  [R0805']  8.76,15.45 90 top
R15  10K  [R0805']  14.02,51.76 180 top
R16  10K  [R0805']  12.23,48.39 180 top
R17  10K  [R0805']  40.96,56.79 90 top
R18  10K  [R0805']  69.18,44.05 270 bottom
R19  10K  [R0805']  71.3,39.96 90 bottom
R20  220R  [R0805']  67.67,61.67 90 top
R21  220R  [R0805']  71.73,61.67 90 top
R22  220R  [R0805']  76.96,61.87 90 top
R23  220R  [R0805']  77.01,56.08 270 top
R24  220R  [R0805']  77.01,50.6 270 top
R27  10K  [R0805']  71.53,16.76 90 top
R28  10K  [R0805']  63.6,11.68 0 bottom
R29  10K  [R0805']  71.53,23.43 90 top
R30  10K  [R0805']  68.48,7.16 90 bottom
R31  10K  [R0805']  45.41,48.69 270 top
R32  10K  [R0805']  45.42,54.03 90 top
R33  10K  [R0805']  56.45,53.98 270 top
R34  10K  [R0805']  56.74,62.14 90 top
R40  220R  [R0805']  35.01,13.93 0 top
S3  41.81,6.6 180 top
U1  56.51,36.7 90 top
U2  26.51,35.45 90 top
U3  25.97,12.41 90 top
U4  12.76,42.95 0 bottom
U5  50.37,56.6 90 top
U6  62.41,56.62 90 top
U9  37.13,56.95 90 top
U10  33.58,56.95 90 top
U11  30.02,56.95 90 top
U12  26.47,56.95 90 top
U13  22.91,56.95 90 top
U14  19.35,56.95 90 top
U15  12.24,56.95 90 top
U16  15.8,56.95 90 top
U$2  59.13,6.86 180 top
X1  25.93,4.38 0 top

### Tracks (layer width: path | path; a pad name or v marks a point on that pad's centre or on a via)
+3V3  (via drill 0.5 pad 1.27, 0.51 pad 1.27)
  Top 0.229: U2.20 31.11,33.19 | R6.1 34.76,20.95 32.51,18.7 29.96,18.7 v29.91,18.65 29.91,18.79 28.03,20.67 28.03,22.7 L3.1 | L2.1 21.01,24.7 20.26,23.95 20.26,21.2 v18.31,19.25 | v22.76,35.7 | U2.50 22.76,38.7 v22.76,35.7 | 18.44,35.7 U2.56 v22.76,35.7 | v6.76,42.7 7.01,42.45 7.41,42.85 | 18.44,35.7 18.43,35.7 | v6.76,42.7 6.76,41.45 7.76,40.45 14.26,40.45 15.26,39.45 15.26,38.88 18.44,35.7 | 6.31,21.45 4.26,21.45 4.26,32.2 | 4.26,32.2 4.26,43.95 6.76,43.95 v6.76,42.7 | R4.1 5.01,31.95 | 5.01,31.95 4.51,31.95 4.26,32.2 | v5.01,31.45 5.01,31.95 | 12.59,32.3 R4.1 | R3.1 13.56,34.43 13.56,33.31 12.64,32.4 R4.1
  Top 0.254: 31.11,33.19 31.11,38.7 | 8.71,19.25 R10.2
  Top 0.28: U2.42 25.73,46.41 v26.47,47.14 | 6.31,21.45 8.51,19.25 8.71,19.25 v18.31,19.25 | v32.31,41.45 30.71,39.85 30.71,38.7 31.11,38.7 U2.31 | 31.11,33.19 30.71,33.19 30.71,31.45 v32.31,29.85
  Bottom 0.229: v32.31,41.45 26.56,35.7 v22.76,35.7 C36.1 | 6.7,42.61 v6.76,42.7 6.85,42.76 11.88,42.76 14.62,45.51 14.62,46.07 U4.8 | R2.1 12.18,32.2 11.12,31.13 5.33,31.13 5.02,31.44 v5.01,31.45
  Bottom 0.254: 28.66,47.14 28.71,47.15 C35.1 28.71,46.95 33.91,41.75 33.91,41.67
  Bottom 0.28: 18.31,17.85 23.71,17.85 26.23,15.33 IC1.2 27.51,16.05 28.11,16.05 29.91,17.85 v29.91,18.65 | 18.31,17.85 18.15,17.85 C32.1 14.19,16.47 C3.1 | v18.31,19.25 18.31,17.85 | 34.6,28.63 C33.1 33.39,28.77 v32.31,29.85 | C34.1 33.91,41.67 32.53,41.67 v32.31,41.45
  Bottom 0.406: v26.47,47.14 28.66,47.14
+5V  (via drill 0.5 pad 2.54)
  Top 0.28: S3.3 S3.6
  Top 1.27: v14.33,10.57 F1.2
  Bottom 0.28: v14.33,10.57 11.14,10.57 L1.1
  Bottom 1.27: S3.6 37.85,10.57 v14.33,10.57
EECS  (via drill 0.51)
  Top 0.229: R4.2 14.57,32.2 v16.76,32.2 16.86,32.2 U2.63
  Bottom 0.229: 14.67,39.77 U4.1 14.72,39.66 14.72,39 18.48,35.25 18.48,33.92 16.81,32.25 v16.76,32.2
EEDATA  (via drill 0.51)
  Top 0.229: v17.49,34.84 19.12,33.21 20.77,33.21 U2.61
  Bottom 0.229: v17.49,34.84 12.34,34.84 12.23,34.94 R1.1 12.18,35.04 12.18,39.77 U4.3
EESK  (via drill 0.51)
  Top 0.229: U2.62 17.67,32.71 15.94,34.43 15.49,34.43 R3.2 15.84,34.53 13.5,36.87 v13.5,36.91
  Bottom 0.229: 13.45,39.77 U4.2 13.5,39.66 v13.5,36.91
GCLK  (via drill 0.5 pad 1.27)
  Top 0.28: U1.12 55.93,27.48 v55.42,26.97
  Bottom 0.28: v55.42,26.97 58.76,26.97 QG1.3
GND  (via drill 0.5, 0.5 pad 1.27, 0.51, 0.51 pad 1.27, 0.61)
  Top 0.2: 19.66,41.9 19.71,41.95 20.61,41.95 22.51,40.05 23.01,40.05 23.21,40.25 23.21,41.15 U2.47 | 19.66,41.9 19.11,41.35 19.11,39.05 19.91,38.25 20.71,38.25 U2.51 | v62.61,41.05 63.01,40.65 64.01,40.65 U1.46 | v19.61,46.65 19.61,41.95 19.66,41.9 | 47.33,41.15 43.11,41.15 39.61,44.65 C43.2
  Top 0.229: 29.25,31.11 U2.35 29.26,41.17 29.26,42.95 30.01,43.7 39.01,43.7 39.51,44.2 39.51,44.65 | 29.25,31.11 29.76,30.6 U2.15 29.81,29.63 | v36.59,35.17 36.09,35.68 36.01,35.7 U2.25 | 29.25,31.11 28.77,30.62 U2.13 28.76,28.45 27.75,28.45 U2.11 27.74,28.45 27.26,28.45 27.26,29.76 | U1.11 55.52,29.1 55.03,29.1 U1.10 55.01,29.2 55.01,30.39 | 49.98,34.41 49.78,34.2 48.91,34.2 U1.93 | 49.98,34.41 49.98,35.47 49.75,35.7 48.91,35.7 U1.90 | 55.01,30.39 51.05,34.36 50.08,34.36 49.98,34.41 | v55.31,30.7 55.01,30.39 | 40.17,24.09 v42.79,26.71 | v60.06,37.94 60.14,38.02 | U3.2 29.97,12.41 | 29.97,12.41 30.26,12.7 30.26,16.2 v31.26,17.2 | 29.97,12.41 29.97,7.63 X1.4 | 39.21,25.05 38.11,25.05 36.01,22.95 36.01,20.79 32.51,17.29 31.35,17.29 v31.26,17.2 | R40.1 34.06,14.39 v31.26,17.2 | v31.26,19.7 31.28,19.7 32.45,20.87 32.45,22.6 C39.2 32.46,24.9 C5.2 | U2.5 24.76,30.7 23.88,31.57 23.63,31.57 | 27.26,29.76 27.26,31.2 25.51,32.95 25.01,32.95 23.63,31.57 | U2.1 22.75,30.69 23.63,31.57 | U2.10 27.27,29.76 27.26,29.76 | 21.76,20.2 C4.2 24.21,20.45 C38.2 | 13.01,29.75 11.79,29.75 C46.1
  Top 0.254: v53.31,55.15 53.31,53.75 U5.10 | JP4.4 17.41,70.85 19.81,70.85 JP4.6 19.91,70.85 22.31,70.85 JP4.8 22.51,70.85 24.91,70.85 JP4.10 25.01,70.85 27.41,70.85 JP4.12 27.61,70.85 30.01,70.85 JP4.14 30.11,70.85 32.51,70.85 JP4.16 32.61,70.85 35.01,70.85 JP4.18 35.21,70.85 37.61,70.85 JP4.20 37.71,70.85 39.91,68.65 45.51,68.65 JP3.1 | 55.19,42.97 60.14,38.02 61.91,36.25 62.03,36.17 | v38.11,53.65 38.11,53.55 39.41,52.25 39.41,44.85 C43.2 39.51,44.65 | 47.33,41.15 48.71,41.15 U1.79 | v61.41,39.25 57.91,42.75 57.91,44.25 U1.60 | v66.81,52.25 65.41,53.65 U6.10 | 39.21,25.05 IC2.1 39.31,24.95 40.17,24.09 41.21,23.05 41.21,18.15 C60.2 | U2.1 22.71,29.75 13.01,29.75
  Top 0.28: U1.79 53.39,41.17 55.19,42.97 55.45,43.23 U1.65 | U1.32 62.03,33.68 62.03,36.17 U1.37 | C60.2 41.31,16.07 C50.2 | U9.3 38.07,53.65 v38.11,53.65 | v13.31,53.65 13.31,55.65 U15.3 | U10.3 34.52,53.84 v34.71,53.65 | U11.3 30.96,53.7 v30.71,53.65 | U12.3 27.41,53.75 v27.51,53.65 | U13.3 23.85,53.79 v23.71,53.65 | U14.3 20.29,53.66 v20.31,53.65 | U16.3 16.74,53.68 v16.71,53.65 | U16.1 14.86,53.7 v14.91,53.65
  Top 0.61: C4.2 21.76,19.7 19.51,17.45 13.01,17.45 11.51,15.95 11.51,7.95 10.26,6.7
  Top 1.016: LED6.A 8.76,8.2 10.26,6.7 12.58,4.38 X1.S1
  Top 1.27: X1.4 29.43,5.13 | 29.43,5.13 29.43,4.96 30.02,4.37 X1.S2 | X1.S1 28.67,4.38 29.43,5.13
  Bottom 0.2: v62.61,41.05 62.71,41.05 62.76,41 | C70.2 45.01,42.55 39.21,42.55 38.41,41.75 38.31,41.75 | v19.61,46.65 19.41,46.65 18.11,45.35 C40.2
  Bottom 0.229: 38.31,35.17 v36.59,35.17 | C62.2 50.54,26.3 54.93,30.7 v55.31,30.7 55.36,30.8 55.36,33.19 60.01,37.84 v60.06,37.94 61.31,39.18 v61.41,39.25 | C73.1 68.9,25.14 68.9,28.34 66.62,30.62 C68.2 | v42.79,26.71 42.79,29.43 C72.2 | v31.26,17.2 v31.26,19.7 28.26,22.7 C41.2 | 32.97,17.29 31.35,17.29 v31.26,17.2 | C31.2 30.32,16.26 v31.26,17.2 | 28.61,22.05 28.49,22.04 28.19,21.73 28.11,21.65 | 26.81,21.65 25.26,23.2 R5.1 | C3.2 11.7,14.5 9.99,16.22 C45.1 10.01,22.95 | 10.01,27.97 C46.1 | C46.1 11.17,29.13 19.83,29.13 20.71,28.25 C42.2 | 10.01,22.95 | 10.01,22.95 10.01,27.93 C46.1 | 10.31,50.45 v8.56,51.65 8.6,51.6 U4.5 | C36.2 22.71,39.45 17.76,39.45 17.61,39.6 17.61,40.45
  Bottom 0.254: C71.2 58.31,53.95 56.01,51.65 C65.2 56.21,51.35 53.31,54.25 v53.31,55.15 53.21,55.15 45.51,62.85 45.37,62.85 | 17.61,40.45 17.61,42.95 C6.2 | 10.31,50.45 10.31,50.95 13.01,53.65 v13.31,53.65 | 15.71,53.65 15.71,46.25 16.61,45.35 17.71,45.35 C40.2 | v38.11,53.65 38.51,53.65 45.31,60.45 45.31,61.85 C80.2 | 50.42,25.05 55.21,25.05 57.21,23.05 58.91,23.05 QG1.2 | C73.1 68.91,24.95 68.91,22.55 C53.2 | v61.41,39.25 61.41,39.65 62.66,40.9 | 62.66,40.9 62.76,41 66.81,45.05 C69.2 66.81,45.15 v66.81,52.25 | 62.66,40.9 65.46,38.1 | 65.46,38.1 68.71,34.85 70.91,34.85 C63.2 | C68.2 66.41,30.75 65.41,31.75 65.41,38.05 65.46,38.1 | 32.96,45.3 36.51,41.75 C34.2 36.71,41.75 38.31,41.75 38.31,35.17 38.31,30.85 38.36,30.8 | 32.96,45.3 31.21,47.05 30.71,47.05 C35.2 | 38.36,30.8 39.61,32.05 C64.2 | 38.36,30.8 36.41,28.85 C33.2 36.31,28.65 36.31,23.25 35.11,22.05 | 35.11,22.05 35.11,20.45 C61.2 | 28.11,21.65 26.81,21.65 26.81,17.65 IC1.1 | 28.61,22.05 35.11,22.05 | 37.11,53.65 37.11,49.45 32.96,45.3
  Bottom 0.28: JP3.1 45.43,68.55 C81.2 45.37,64.19 45.37,62.85 C80.2 | R30.1 68.48,5.59 U$2.2 64.21,3.56 54.05,3.56 U$2.10 53.37,5.59 50.71,8.25 50.71,12.78 C66.2 45.76,20.13 C52.2 46.82,20.34 C67.2 50.42,25.05 50.42,26.17 C62.2 | C1.1 16.8,6.94 X1.S1 | C3.2 14.23,14.57 C32.2 | C61.2 34.99,20.18 C51.2 32.97,17.29 C2.2 | v38.11,53.65 37.11,53.65 v34.71,53.65 v30.71,53.65 v27.51,53.65 v23.71,53.65 v20.31,53.65 v16.71,53.65 15.71,53.65 v14.91,53.65 v13.31,53.65 | JP4.4 16.11,69.65 13.71,69.65 13.71,66.69 C21.2 C20.2
  Bottom 0.5: C40.2 17.92,43.29 C6.2
N$1
  Top 0.229: U2.7 25.75,12.08 25.11,11.45 U3.6
  Top 0.7: U3.6 24.77,7.24 X1.2
N$2
  Top 0.229: U2.8 26.26,12 26.84,11.42 U3.1
  Top 0.7: U3.1 27.17,7.33 X1.3
N$3
  Bottom 0.28: L1.2 26.37,12.6 IC1.3 30.12,13.02 C31.1 32.92,13.21 C2.1
N$4
  Top 0.229: U2.2 23.26,28.9 22.24,27.88 16.81,27.88 Q1.2 16.71,27.93 12.54,27.93 C46.2
N$5
  Top 0.229: U2.3 23.77,28.74 18.08,23.05 16.81,23.05 Q1.1 16.71,22.95 C45.2
N$6
  Top 0.229: U2.16 30.27,28.9 30.83,28.34 49.77,28.34 U1.1
N$7
  Top 0.229: U2.17 33.98,31.69 34.97,30.7 U1.100
N$8
  Top 0.229: U2.18 34.13,32.2 35.12,31.21 48.89,31.21 U1.99
N$9
  Top 0.229: U2.19 34.28,32.71 35.27,31.71 48.89,31.71 U1.98
N$10
  Top 0.229: U2.21 33.95,33.7 35.45,32.2 U1.97
N$11
  Top 0.229: U2.22 34.87,34.2 36.36,32.71 U1.96
N$12
  Top 0.229: U2.23 35.04,34.69 36.57,33.16 47.92,33.16 47.95,33.19 48.81,33.19 U1.95
N$13
  Bottom 0.229: R2.2 10.3,32.25 R1.2 10.36,35.04 10.86,35.55 10.86,39.77 U4.4
N$14
  Top 0.229: U2.24 35.2,35.19 36.26,34.13 41.5,34.13 42.46,35.09 47.39,35.09 47.79,34.69 48.81,34.69 U1.92
N$15  (via drill 0.51 pad 1.27)
  Top 0.229: v25.26,31.7 U2.6
  Bottom 0.229: R5.2 v25.26,31.7
N$16
  Top 0.229: U2.26 37.13,36.21 38.75,34.58 41.14,34.58 42.21,35.65 47.49,35.65 47.95,35.19 48.81,35.19 U1.91
N$17
  Top 0.28: L4.2 39.58,15.8 C50.1 39.45,18.03 C60.1 39.41,20.32 IC2.3
N$18
  Top 0.28: 73.71,52.71 LED3.A 73.74,57.71 R22.1
N$19
  Top 0.28: LED2.A 70.51,59.5 R21.1
N$20
  Bottom 0.254: 64.08,25.05 67.01,25.05 C73.2 67.01,24.95 67.01,22.55 C53.1 67.01,22.45 67.01,19.95 L5.2
  Bottom 1.27: QG1.4 64.08,25.05 QG1.1
N$21
  Top 0.28: LED1.A R20.1
N$22
  Top 0.229: U2.27 38.93,36.69 40.35,35.27 41.17,35.27 42.11,36.21 48.89,36.21 U1.89
N$24
  Top 0.229: U2.28 U1.87
N$25
  Top 0.229: U2.29 32.25,37.68 48.81,37.68 U1.86
N$27
  Top 0.229: U2.14 29.25,28.9 31.49,26.66 34.74,26.66 R6.2
N$28
  Top 0.28: U2.38 27.74,43.78 30.21,46.25 37.11,46.25 37.13,46.27 U9.2
N$29
  Top 0.229: 48.81,38.19 U1.85 48.71,38.19 U2.30
N$30
  Top 0.229: U2.32 34.21,39.21 34.74,38.67 48.81,38.67 U1.84
N$31
  Top 0.28: U2.39 27.26,44.22 29.89,46.85 33.51,46.85 33.58,46.92 U10.2
N$32
  Top 0.229: U2.33 30.27,42.26 30.57,42.56 39.97,42.56 43.37,39.17 U1.83
N$33
  Top 0.28: U2.41 26.24,45.14 27.99,46.89 27.99,50.14 26.47,51.66 U12.2
N$34
  Top 0.229: U2.34 29.76,42.41 30.37,43.02 40.58,43.02 43.93,39.66 48.81,39.66 U1.82
N$35
  Top 0.28: U1.52 61.95,46.96 64.7,49.71 U6.9
N$36
  Top 0.28: U6.8 64.04,49.82 61.44,47.22 U1.53
N$37
  Top 0.28: U1.54 60.93,47.47 63.38,49.92 U6.7
N$38
  Top 0.28: U1.55 60.43,47.73 62.74,50.04 U6.6
N$39
  Top 0.28: U1.56 59.94,48.01 62.08,50.15 U6.5
N$40
  Top 0.28: U6.4 61.45,50.27 59.44,48.26 U1.57
N$41
  Top 0.28: U1.58 58.93,48.51 60.79,50.37 U6.3
N$42
  Top 0.28: U6.2 60.13,52.46 59.03,51.36 58.22,51.36 57.43,50.57 U1.61
N$43
  Top 0.28: U1.66 54.94,51.51 R33.2 59.49,53.03 U6.1
N$44
  Top 0.28: U1.67 54.43,56.06 56.08,57.71 60.13,57.71 U6.19 60.13,61.89 58.93,63.09 R34.2
N$45
  Top 0.28: U1.68 53.95,48.26 52.66,49.55 U5.9
N$46
  Top 0.28: U1.69 53.44,47.75 52,49.19 U5.8
N$47
  Top 0.28: U1.70 52.93,47.24 51.34,48.84 U5.7
N$48
  Top 0.28: U1.71 52.45,46.71 50.7,48.46 U5.6
N$49
  Top 0.28: U1.72 51.94,46.2 50.04,48.1 U5.5
N$50
  Top 0.28: U1.73 51.43,45.69 49.41,47.72 U5.4
N$51
  Top 0.28: U1.74 50.93,45.19 48.75,47.36 U5.3
N$52
  Top 0.28: U5.2 48.09,46.65 U1.75
N$54
  Top 0.28: U1.76 47.45,44.04 47.45,47.74 | 47.45,47.74 U5.1 | R31.2 47.45,47.74
N$55
  Top 0.28: U1.77 47.07,42.19 43.23,46.02 43.23,54.41 43.79,54.97 45.41,54.97 R32.2 48.09,57.65 U5.19
N$56
  Top 0.28: U11.4 31.8,57.4 31.8,51.94 30.91,51.05 30.91,48.79 26.75,44.63 U2.40
N$57
  Top 0.254: U15.2 12.31,55.65 12.31,52.55 13.01,51.85 R15.2
  Top 0.28: U2.52 19.5,37.7 18.49,38.71 18.49,46.35 R15.2
N$58
  Top 0.28: U2.48 22.74,42.29 21.54,43.48 21.54,46.99 19.35,49.18 U14.2
N$59  (via drill 0.5 pad 1.27)
  Top 0.28: U2.53 19.3,37.19 17.88,38.61 | 17.88,38.61 17.68,38.81 | v18.51,47.85 18.51,55.65 U14.1 | v16.71,46.65 17.31,46.65 17.91,46.05 17.91,38.65 17.88,38.61
  Bottom 0.28: v18.51,47.85 17.51,46.85 16.91,46.85 v16.71,46.65
N$60
  Top 0.28: U2.54 19.1,36.68 16.51,38.93 16.51,44.45 14.31,44.97 11.31,48.36 R16.2 11.3,48.41 U15.1
N$61
  Top 0.28: U2.46 23.75,42.64 22.25,44.14 22.25,46.48 24.69,48.91 24.69,57.45 23.9,58.24 U13.4
N$62  (via drill 0.5 pad 1.27)
  Top 0.28: U2.45 24.25,43.91 v23.51,44.65 | v17.31,51.05 17.71,51.45 17.71,58.25 17.7,58.24 U16.4
  Bottom 0.28: v23.51,44.65 17.31,50.85 v17.31,51.05
N$63
  Top 0.28: R23.2 75.29,53.41 75.29,50.39 LED4.A
N$64
  Top 0.28: U1.50 64.06,47.19 70.51,53.64 LED2.C
N$65
  Top 0.28: U1.49 65.25,42.19 66.04,42.98 66.04,47.07 LED3.C
N$66
  Top 0.28: L4.1 41.58,9.37 S3.5 S3.2
N$67
  Top 0.28: U1.48 65.56,41.68 66.65,42.77 66.65,46.23 70.82,50.39 LED4.C
N$68
  Top 0.28: U1.27 65.96,31.17 67.97,29.16 75.23,29.16 JP2.14
N$69
  Top 0.28: U1.23 61.44,27.8 R27.2 70.98,17.17 70.41,17.17 69.19,15.95 69.19,13.82 68.07,12.7 58.62,12.7 U$2.9
N$70  (via drill 0.5 pad 1.27)
  Top 0.28: U1.22 60.93,26.24 v69.19,17.98
  Bottom 0.28: U$2.5 59.13,8.16 R28.2 62.65,13.31 67.67,13.31 69.19,14.83 v69.19,17.98
N$71  (via drill 0.5 pad 1.27)
  Top 0.28: U1.24 61.95,28.07 69.7,20.32 v71.53,20.32
  Bottom 0.28: v71.53,20.32 71.53,11.16 R30.2 64.23,8.11 U$2.1
N$72
  Top 0.28: U1.25 62.43,28.35 66.4,24.38 R29.2 74.07,24.38 74.07,12.9 71.53,10.36 63.91,10.36 U$2.3
N$73
  Top 0.28: U1.42 68.55,38.68 73.05,43.18 JP2.1
N$74
  Top 0.28: U1.40 69.47,37.67 72.44,40.64 JP2.3
N$75
  Top 0.28: U5.11 53.3,64.22 55.68,66.6 JP3.9
N$76
  Top 0.28: U5.13 52,65.97 53.14,67.11 JP3.7
N$77
  Top 0.254: JP3.5 50.61,68.55 50.7,68.52
  Top 0.28: U5.15 50.7,68.52
N$78
  Top 0.28: U5.17 49.41,66.01 48.06,67.36 JP3.3
N$79
  Top 0.28: U6.18 60.79,64.79 58.22,67.36 JP3.11
N$80
  Top 0.28: U6.16 62.08,66.03 60.76,67.36 JP3.13
N$81
  Top 0.28: U6.14 63.38,68.55 JP3.15
N$82
  Top 0.28: U6.12 64.7,66.21 65.84,67.35 JP3.17
N$83
  Top 0.28: U5.18 48.75,65.4 46.79,67.36 46.79,69.9 JP3.4
N$84
  Top 0.28: U5.16 50.04,67.15 49.33,67.87 49.33,69.9 JP3.6
N$85
  Top 0.28: U5.14 51.34,67.34 51.87,67.87 51.87,69.9 JP3.8
N$86
  Top 0.28: U5.12 52.66,65.11 54.41,66.85 54.41,69.9 JP3.10
N$87
  Top 0.28: U6.17 61.45,65.14 59.49,67.11 59.49,69.9 JP3.12
N$88
  Top 0.28: U6.15 62.74,66.9 62.03,67.61 62.03,69.9 JP3.14
N$89
  Top 0.28: U6.13 64.04,66.62 64.57,67.11 64.57,69.9 JP3.16
N$90
  Top 0.28: JP3.18 67.06,69.95 67.06,67.06 65.34,65.34 U6.11
N$91
  Top 0.28: U1.29 66.47,32.18 67.67,30.99 70.41,30.99 71.12,31.7 75.23,31.7 JP2.12
N$92
  Top 0.28: U1.26 65.63,30.68 68.38,27.94 JP2.13
N$93
  Top 0.28: U1.28 66.22,31.67 67.41,30.48 JP2.11
N$94
  Top 0.28: U1.33 65.58,34.19 66.09,33.68 71.17,33.68 71.73,34.24 75.23,34.24 JP2.10
N$95  (via drill 0.5 pad 1.27)
  Top 0.28: U1.44 67.82,39.67 68.69,40.55 v68.69,41.36
  Bottom 0.28: v68.69,41.36 69.18,41.85 R18.2
N$96  (via drill 0.5 pad 1.27)
  Top 0.28: U1.43 68.13,39.17 71.32,42.36 v71.32,43.18
  Bottom 0.28: v71.32,43.18 71.32,40.93 R19.2
N$97
  Top 0.28: U1.36 66.83,35.69 67.36,35.15 69.39,35.15 72.34,38.1 JP2.5
N$98
  Top 0.28: U1.30 66.73,32.69 67.74,31.67 70.13,31.67 71.48,33.02 JP2.9
N$99
  Top 0.28: U1.35 66.42,35.18 66.93,34.67 70,34.67 72.11,36.78 75.23,36.78 JP2.8
N$100
  Top 0.28: U1.34 66.01,34.67 66.5,34.19 70.56,34.19 71.93,35.56 JP2.7
N$101
  Top 0.28: U1.41 68.96,38.18 72.64,41.86 75.23,41.86 JP2.4
N$102
  Top 0.28: U1.38 66.75,36.68 67.77,35.66 68.88,35.66 72.54,39.32 75.23,39.32 JP2.6
N$103
  Top 0.28: LED5.A 75.42,48.06 R24.2
N$104
  Top 0.28: U1.2 50.93,28.17 47.65,24.89 47.65,19.05 JP1.1
N$105
  Top 0.28: U1.3 51.43,27.76 48.87,25.2 JP1.2
N$106
  Top 0.28: U1.4 51.94,27.25 50.19,25.5 50.19,19.05 JP1.3
N$107
  Top 0.28: U1.15 57.43,25.02 56.49,24.08 JP1.8
N$108
  Top 0.28: U1.7 53.44,20.88 JP1.6
N$109
  Top 0.28: U1.17 58.45,23.44 59.03,22.86 JP1.10
N$110
  Top 0.28: U1.19 59.44,24.49 61.57,22.35 JP1.12
N$111
  Top 0.28: U1.8 53.95,23.27 55.07,22.15 55.07,19.25 JP1.7
N$112
  Top 0.28: U1.21 60.43,25.53 64.11,21.84 JP1.14
N$113
  Top 0.28: U1.20 59.94,24.99 62.89,22.05 62.89,19.05 JP1.13
N$114
  Top 0.28: U1.6 52.93,26.21 52.73,26.01 52.73,19.05 JP1.5
N$115
  Top 0.28: U1.18 58.93,23.98 60.25,22.66 60.25,19.15 JP1.11
N$116
  Top 0.28: U1.16 57.94,18.92 JP1.9
N$117
  Top 0.28: U1.5 52.45,26.75 51.41,25.7 JP1.4
N$118  (via drill 0.5 pad 1.27)
  Top 0.28: U2.44 24.74,45.53 v23.93,46.35
  Bottom 0.28: 23.91,46.35 v23.93,46.35 23.93,46.22 R7.1
N$119
  Top 0.2: U13.2 23.01,55.75 23.01,60.75 27.41,65.15 27.48,65.2
  Top 0.28: 27.48,65.2 JP4.11
N$120  (via drill 0.5 pad 1.27)
  Top 0.28: v19.86,65.77 JP4.5
  Top 0.406: v34.59,65.77 34.59,58.47 U10.4
  Bottom 0.406: v19.86,65.77 v34.59,65.77
N$121
  Top 0.28: 17.32,65.06 JP4.3
  Top 0.406: U14.4 20.35,62.04 17.32,65.06
N$122
  Top 0.28: U1.47 65.96,41.17 67.36,42.57 67.36,45.11 70.31,48.06 LED5.C
N$123  (via drill 0.5 pad 1.27)
  Top 0.28: v24.94,64.7 JP4.9
  Top 0.406: v38.15,64.7 38.15,58.47 U9.4
  Bottom 0.406: v24.94,64.7 v38.15,64.7
N$124  (via drill 0.5 pad 1.27)
  Top 0.28: v22.4,62.16 JP4.7
  Top 0.406: U12.4 27.48,58.47 v27.48,62.16
  Bottom 0.406: v22.4,62.16 v27.48,62.16
N$125
  Top 0.28: JP4.13 U11.2
N$126  (via drill 0.5 pad 1.27)
  Top 0.28: JP4.15 v32.56,63.43
  Top 0.406: v13.26,63.43 13.26,58.47 U15.4
  Top 0.6: U15.4 14.02,58.24 14.02,56.95 15.8,56.95 U16.2
  Bottom 0.406: v32.56,63.43 v13.26,63.43
N$127  (via drill 0.5 pad 1.27)
  Top 0.254: R17.1 40.91,55.85 39.31,55.85 38.51,56.65 36.71,56.65 36.01,55.95 U9.1
  Top 0.28: 25.65,49.7 v25.85,49.9 25.26,49.31 U2.43
  Top 0.6: U13.1 21.97,49.9 v21.89,49.9 | v36.12,49.9 36.12,55.65 U9.1 | U11.1 29.08,49.9 v29.01,49.9 | U10.1 32.64,49.9 v32.56,49.9 | U12.1 25.53,49.97 v25.85,49.9
  Bottom 0.6: v21.89,49.9 v25.85,49.9 v29.01,49.9 v32.56,49.9 v36.12,49.9
N$128
  Top 0.7: X1.1 22.43,12.41 U3.5
  Top 1.27: F1.1 20.72,14.12 22.43,12.41
  Bottom 0.28: C1.2 21.59,7.92 X1.1
N$129
  Top 0.229: LED10.C 36.64,14.6 R40.2
N$130
  Top 0.28: U1.51 62.43,46.48 67.67,51.71 LED1.C
N$131
  Top 0.229: LED6.C R10.1
N$132  (via drill 2.8 pad 3.81)
  other vias: 78.31,3.85
N$133  (via drill 2.8 pad 3.81)
  other vias: 6.71,4.05
N$134  (via drill 2.8 pad 3.81)
  other vias: 4.71,73.25
N$135  (via drill 2.8 pad 3.81)
  other vias: 78.11,73.25
VCC  (via drill 0.5 pad 1.27, 0.61)
  Top 0.2: JP4.1 14.81,68.35 14.81,70.85 JP4.2
  Top 0.254: v23.31,48.85 21.51,48.85 20.91,49.45 20.91,52.85 21.31,53.25 21.31,57.55 21.91,58.15 U13.5 | v14.96,48.25 13.11,47.15 13.11,48.35 R16.1 | v17.11,49.65 15.01,51.75 R15.1 | R17.2 40.91,57.65 38.91,57.65 38.51,57.25 37.31,57.25 36.31,58.25 U9.5
  Top 0.28: U9.5 36.19,60.05 v36.11,60.05 | v11.31,60.25 U15.5 | U10.5 32.64,60.25 v32.71,60.25 | U11.5 29.08,60.25 v28.71,60.25 | U12.5 25.53,60.25 v25.51,60.25 | U13.5 21.97,60.25 v21.91,60.25 | U14.5 18.41,60.25 v18.51,60.25 | U16.5 14.86,60.25 v14.71,60.25
  Bottom 0.254: R7.2 27.71,44.25 27.71,44.45 v23.31,48.85 21.51,48.85 18.31,52.05 16.91,52.05 16.31,51.45 16.31,50.65 17.11,49.85 v17.11,49.65 | v14.96,48.25 7.01,48.25 5.91,46.85 5.91,58.35 7.71,60.15 7.71,60.25
  Bottom 0.28: v36.11,60.05 36.11,60.25 v32.71,60.25 v28.71,60.25 v25.51,60.25 v21.91,60.25 v18.51,60.25 v14.71,60.25 v11.31,60.25 7.71,60.25 7.71,70.85 12.02,70.85 C21.1 | C21.1 C20.1 | JP4.2 12.02,70.87 C21.1
VCCINT  (via drill 0.5 pad 1.27, 0.51)
  Top 0.229: v40.76,36.24 41.47,36.24 41.93,36.69 48.76,36.69 U1.88 | LED10.A 36.64,19.93 C61.1 37.03,22.57 v37.11,22.65
  Top 0.28: v56.44,47.04 U1.63 56.44,42.98 62.23,37.19 U1.39 67.82,37.19 v68.33,36.68 | U1.88 51.05,36.68 56.44,31.29 U1.13 v56.44,25.7 | IC2.2 37.21,22.75 v37.11,22.65
  Bottom 0.229: v40.76,36.24 40.4,35.88 40.4,34.13 C64.1
  Bottom 0.254: v68.33,36.68 68.41,36.65 70.81,36.65 C63.1 71.01,36.65 72.51,35.15 72.51,24.05 69.11,20.65 69.11,19.95 L5.1 69.01,19.85 68.61,19.85 67.71,18.95 63.91,18.95 62.71,20.15 62.71,21.25 58.31,25.65 56.51,25.65 v56.44,25.7
  Bottom 0.28: v56.44,47.04 56.44,49.15 C65.1 | 39.67,34.02 C64.1 40.35,34 41.31,33.05 41.31,25.36 D1.2 D1.1 37.33,22.43 v37.11,22.65 37.11,20.4 C61.1 37.03,17.34 C51.1 | v56.44,25.7 52.85,25.7 C62.1
VCCIO  (via drill 0.5 pad 1.27, 0.51)
  Top 0.229: 51,33.68 50.89,33.67 48.91,33.67 U1.94 48.71,33.7 47.95,33.7 47.52,34.13 v43.3,34.13
  Top 0.254: 61.61,2.05 61.61,5.55 U$2.4
  Top 0.28: 51,33.68 52.27,32.41 | 52.27,32.41 54.43,30.25 U1.9 54.43,24.41 v54.91,23.93 | U1.80 52.37,40.67 59.87,33.17 U1.31 68.15,33.17 v68.66,32.66 | v58.47,50.09 58.45,50.06 U1.59 58.45,43.23 61.49,40.18 U1.45 66.5,40.18 v67.01,40.69 | R29.1 73.15,22.48 73.15,15.81 R27.1 71.53,12.09 v69.8,12.09 | v51.51,31.85 51.71,31.85 52.27,32.41 | v66.91,64.85 67.67,64.09 R20.2 69.49,64.45 71.11,64.45 71.73,63.83 R21.2 76.76,62.62 R22.2 78.13,62.82 78.91,62.05 78.91,58.93 R23.1 78.13,57.03 78.91,56.25 78.91,53.44 77.41,51.95 | 77.41,51.95 R24.1 | JP2.2 78.04,43.18 | 78.04,43.18 79.11,44.25 79.11,50.25 77.41,51.95 | v71.51,27.05 72.91,25.65 75.91,25.65 | 75.91,25.65 79.11,22.45 79.11,10.25 70.91,2.05 61.61,2.05 48.71,2.05 47.51,3.25 47.51,11.85 v46.31,13.05 | 75.91,25.65 77.11,25.65 78.91,27.45 78.91,42.31 78.04,43.18
  Bottom 0.229: 42.82,34.13 42.82,38.52 45.03,40.73 C70.1 | 42.82,34.13 C72.1 | v43.3,34.13 42.82,34.13
  Bottom 0.254: R18.1 69.11,44.95 66.91,42.75 C69.1
  Bottom 0.28: v58.47,50.09 58.47,52.04 C71.1 62.97,52.11 65.71,54.85 65.71,63.65 v66.91,64.85 | v54.91,23.93 53.56,23.93 C67.1 | v69.8,12.09 69.39,11.68 R28.1 64.55,11.01 62.99,9.45 62.99,6.91 U$2.4 | v51.51,31.85 43.04,23.38 D1.3 43.97,21.89 C52.1 43.86,20.23 C66.1 43.86,15.5 v46.31,13.05 | C69.1 66.85,40.85 v67.01,40.69 68.68,39.01 R19.1 | C68.1 66.57,32.66 v68.66,32.66 71.51,29.81 v71.51,27.05
VCORE  (via drill 0.5 pad 1.27, 0.51 pad 1.27)
  Top 0.229: 26.01,37.39 25.76,37.14 25.76,35.45 v22.76,32.45 22,31.69 U2.64 | U2.12 v28.26,31.7 v28.25,31.71 28.25,37.39 26.51,37.39
  Top 0.28: v20.12,40.94 20.78,40.28 U2.49 23.26,39.2 23.9,39.2 25.7,37.39 26.01,37.39 26.51,37.39 26.97,37.39 27.1,37.51 27.1,39.2 28.25,40.35 U2.37 28.26,43.4 29.51,44.65 37.43,44.65 C43.1
  Bottom 0.229: C41.1 v28.26,31.7 | C42.1 v22.76,32.45
  Bottom 0.5: v20.12,40.94 20.12,42.76 C6.1 19.75,45.14 C40.1
VEXT  (via drill 0.61)
  Top 0.254: v43.21,59.55 47.41,59.55 U5.20 | v56.51,56.55 56.51,54.95 R33.1 | v58.61,58.65 59.41,59.45 U6.20 | R32.1 45.51,53.15 50.81,58.45 53.91,58.45 56.61,61.15 R34.1
  Top 0.28: U6.20 59.49,60.39 58.72,61.16 56.77,61.16 R34.1 | R31.1 45.42,49.64 R32.1
  Bottom 0.254: v43.21,59.55 43.21,61.65 43.41,61.85 C80.1 | v58.61,58.65 57.46,57.5 | 57.46,57.5 v56.51,56.55 | 57.46,57.5 46.91,68.05 46.91,68.85 45.11,70.65 JP3.2
  Bottom 0.28: JP3.2 43.53,69.19 C81.1 43.47,64.19 C80.1
VPHY
  Top 0.229: U2.4 24.26,29.72 L2.2 C38.1 24.21,22.45 C4.1
VPLL
  Top 0.229: U2.9 26.76,26.05 27.98,24.83 L3.2 28.03,24.73 30.27,24.73 30.47,24.93 C5.1 30.52,24.83 30.52,22.75 C39.1